# Altium project ProjectKvant3DPrinter.PrjPCB
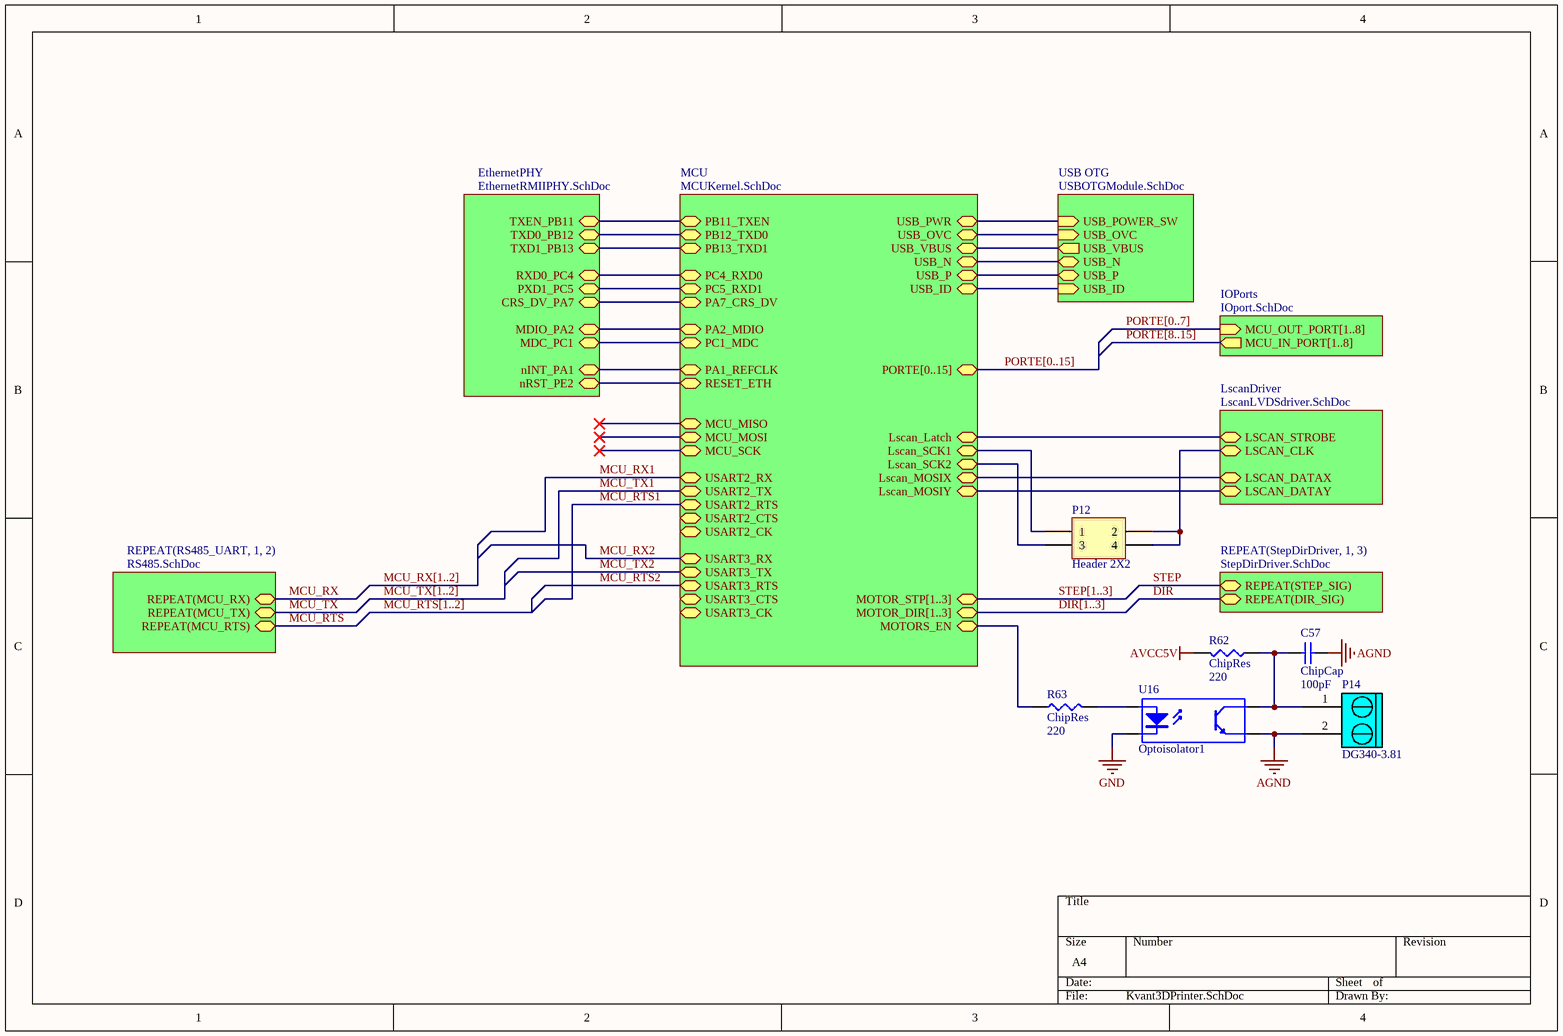
[diagram p0: Kvant3DPrinter.SchDoc]
6 sheets, 88 parts. Net scope: hierarchical (ports join the sheet entries above them; power ports are global).
Board file: PCBKvant3DPrinter_TopologicalSort.PcbDoc
Sheets:
  Kvant3DPrinter.SchDoc
    IOPorts = IOport.SchDoc
      InputPort1 = InputPort.SchDoc
      InputPort2 = InputPort.SchDoc
      InputPort3 = InputPort.SchDoc
      InputPort4 = InputPort.SchDoc
      InputPort5 = InputPort.SchDoc
      InputPort6 = InputPort.SchDoc
      InputPort7 = InputPort.SchDoc
      InputPort8 = InputPort.SchDoc
    LscanDriver = LscanLVDSdriver.SchDoc
    StepDirDriver1 = StepDirDriver.SchDoc
    StepDirDriver2 = StepDirDriver.SchDoc
    StepDirDriver3 = StepDirDriver.SchDoc
  MCUSetup.SchDoc

## Sheet Kvant3DPrinter.SchDoc
size A4

### Parts
C57  ChipCap  value 100pF  [CAP0805]
P12  Header 2X2  [HDR2X2]
P14  DG340-3.81  [DG340-3.81-02P-00A(H)]
R62  ChipRes  value 220  [RES0805]
R63  ChipRes  value 220  [RES0805]
U16  Optoisolator1  [DIP-4]

### Sub-sheets
EthernetPHY = EthernetRMIIPHY.SchDoc (file not in this document): TXEN_PB11, TXD0_PB12, TXD1_PB13, RXD0_PC4, PXD1_PC5, CRS_DV_PA7, MDIO_PA2, MDC_PC1, nINT_PA1, nRST_PE2
IOPorts = IOport.SchDoc: MCU_OUT_PORT[1..8] (in), MCU_IN_PORT[1..8] (out)
LscanDriver = LscanLVDSdriver.SchDoc: LSCAN_STROBE, LSCAN_CLK, LSCAN_DATAX, LSCAN_DATAY
MCU = MCUKernel.SchDoc (file not in this document): RESET_ETH, USB_PWR, USB_OVC, USB_VBUS, USB_N, USB_P, USB_ID, MCU_SCK, MCU_MISO, MCU_MOSI, PORTE[0..15] (bidir), PA2_MDIO, PC1_MDC, PA1_REFCLK, PA7_CRS_DV, PB11_TXEN, PB12_TXD0, PB13_TXD1, PC4_RXD0, PC5_RXD1, Lscan_Latch, Lscan_SCK1, Lscan_SCK2, Lscan_MOSIX, Lscan_MOSIY, USART2_CTS, USART2_RTS, USART2_TX, USART2_RX, USART2_CK, USART3_TX, USART3_RX, USART3_CK, USART3_CTS, USART3_RTS, MOTORS_EN, MOTOR_STP[1..3], MOTOR_DIR[1..3]
REPEAT(RS485_UART, 1, 2) = RS485.SchDoc (file not in this document): REPEAT(MCU_RX), REPEAT(MCU_TX), REPEAT(MCU_RTS)
REPEAT(StepDirDriver, 1, 3) = StepDirDriver.SchDoc: REPEAT(STEP_SIG), REPEAT(DIR_SIG)
USB OTG = USBOTGModule.SchDoc (file not in this document): USB_POWER_SW (in), USB_OVC (in), USB_VBUS (out), USB_N (bidir), USB_P (bidir), USB_ID (in)

### Nets
AGND: C57.2 P14.2 U16.3(E)
AVCC5V: R62.2
GND: U16.2(K)
DIR: sheet REPEAT(StepDirDriver, 1, 3)/REPEAT(DIR_SIG)
MCU_RTS: sheet REPEAT(RS485_UART, 1, 2)/REPEAT(MCU_RTS)
MCU_RTS1: sheet MCU/USART2_RTS
MCU_RTS2: sheet MCU/USART3_RTS
MCU_RX: sheet REPEAT(RS485_UART, 1, 2)/REPEAT(MCU_RX)
MCU_RX1: sheet MCU/USART2_RX
MCU_RX2: sheet MCU/USART3_RX
MCU_TX: sheet REPEAT(RS485_UART, 1, 2)/REPEAT(MCU_TX)
MCU_TX1: sheet MCU/USART2_TX
MCU_TX2: sheet MCU/USART3_TX
STEP: sheet REPEAT(StepDirDriver, 1, 3)/REPEAT(STEP_SIG)
NetC57_1: C57.1 P14.1 R62.1 U16.4(C)
NetP12_1: P12.1 ; sheet MCU/Lscan_SCK1
NetP12_2: P12.2 P12.4 ; sheet LscanDriver/LSCAN_CLK
NetP12_3: P12.3 ; sheet MCU/Lscan_SCK2
NetR56_1: sheet MCU/Lscan_Latch, sheet LscanDriver/LSCAN_STROBE
NetR58_1: sheet MCU/Lscan_MOSIX, sheet LscanDriver/LSCAN_DATAX
NetR59_1: sheet MCU/Lscan_MOSIY, sheet LscanDriver/LSCAN_DATAY
NetR63_1: R63.1 ; sheet MCU/MOTORS_EN
NetR63_2: R63.2 U16.1(A)
(unnamed): sheet MCU/RESET_ETH, sheet EthernetPHY/nRST_PE2
(unnamed): sheet MCU/USB_PWR, sheet USB OTG/USB_POWER_SW
(unnamed): sheet MCU/USB_OVC, sheet USB OTG/USB_OVC
(unnamed): sheet MCU/USB_VBUS, sheet USB OTG/USB_VBUS
(unnamed): sheet MCU/USB_N, sheet USB OTG/USB_N
(unnamed): sheet MCU/USB_P, sheet USB OTG/USB_P
(unnamed): sheet MCU/USB_ID, sheet USB OTG/USB_ID
(unnamed): sheet MCU/PA2_MDIO, sheet EthernetPHY/MDIO_PA2
(unnamed): sheet MCU/PC1_MDC, sheet EthernetPHY/MDC_PC1
(unnamed): sheet MCU/PA1_REFCLK, sheet EthernetPHY/nINT_PA1
(unnamed): sheet MCU/PA7_CRS_DV, sheet EthernetPHY/CRS_DV_PA7
(unnamed): sheet MCU/PB11_TXEN, sheet EthernetPHY/TXEN_PB11
(unnamed): sheet MCU/PB12_TXD0, sheet EthernetPHY/TXD0_PB12
(unnamed): sheet MCU/PB13_TXD1, sheet EthernetPHY/TXD1_PB13
(unnamed): sheet MCU/PC4_RXD0, sheet EthernetPHY/RXD0_PC4
(unnamed): sheet MCU/PC5_RXD1, sheet EthernetPHY/PXD1_PC5

### Buses and harness runs
bus DIR[1..3] = sheet MCU/MOTOR_DIR[1..3]
bus MCU_RTS[1..2]
bus MCU_RX[1..2]
bus MCU_TX[1..2]
bus PORTE[0..7] = sheet IOPorts/MCU_OUT_PORT[1..8]
bus PORTE[0..15] = sheet MCU/PORTE[0..15]
bus PORTE[8..15] = sheet IOPorts/MCU_IN_PORT[1..8]
bus STEP[1..3] = sheet MCU/MOTOR_STP[1..3]

### Library data of the parts
C57 = ChipCap: Capacitor; Published: 8-Jun-2000; LatestRevisionDate: 17-Jul-2002; LatestRevisionNote: Re-released for DXP Platform.; PackageReference: RAD-0.3; Publisher: Altium Limited
P12 = Header 2X2: Header, 2-Pin, Dual row; LatestRevisionDate: 17-Jul-2002; LatestRevisionNote: Re-released for DXP Platform.; Publisher: Altium Limited
P14 = DG340-3.81-02P: Terminal block
R62 R63 = ChipRes: Chip resistor
U16 = Optoisolator1: 4-Pin Phototransistor Optocoupler; Published: 24-Mar-1999; LatestRevisionDate: 04-Mar-2005; LatestRevisionNote: Sch pins 3 & 4 Swapped.; DatasheetVersion: Nov-2003; PackageReference: DIP-4; Publisher: Altium Limited

## Sheet IOport.SchDoc
size A4
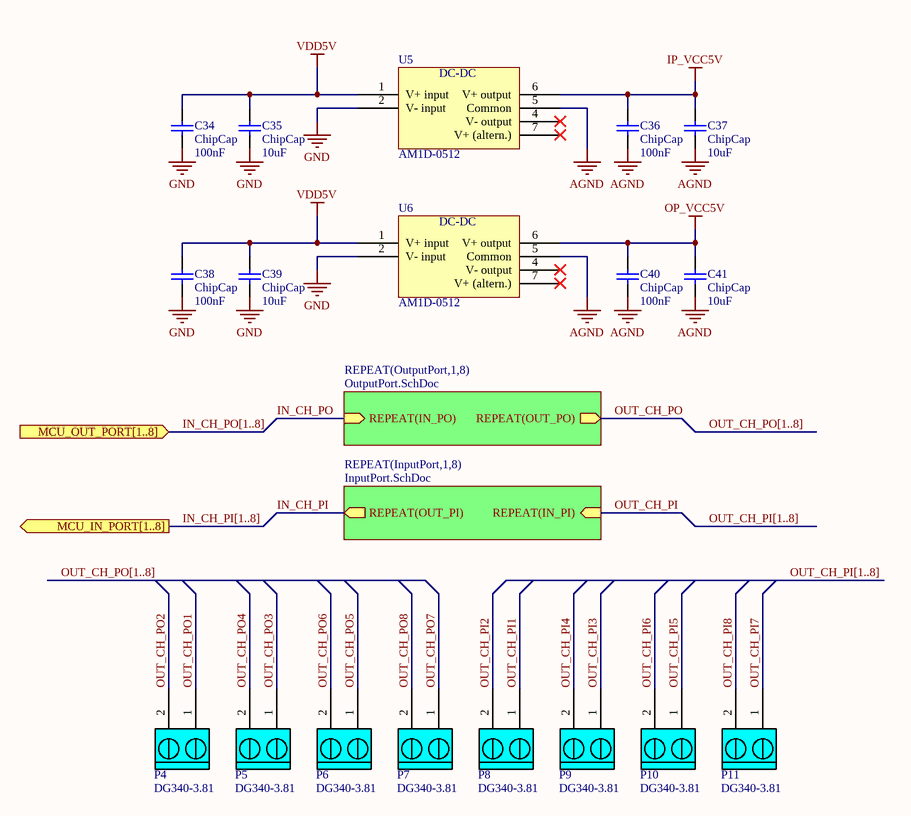
[diagram p1: IOport.SchDoc]

### Parts
C34  ChipCap  value 100nF  [CAP0805]
C35  ChipCap  value 10uF  [CAP0805]
C36  ChipCap  value 100nF  [CAP0805]
C37  ChipCap  value 10uF  [CAP0805]
C38  ChipCap  value 100nF  [CAP0805]
C39  ChipCap  value 10uF  [CAP0805]
C40  ChipCap  value 100nF  [CAP0805]
C41  ChipCap  value 10uF  [CAP0805]
P4  DG340-3.81  [DG340-3.81-02P-00A(H)]
P5  DG340-3.81  [DG340-3.81-02P-00A(H)]
P6  DG340-3.81  [DG340-3.81-02P-00A(H)]
P7  DG340-3.81  [DG340-3.81-02P-00A(H)]
P8  DG340-3.81  [DG340-3.81-02P-00A(H)]
P9  DG340-3.81  [DG340-3.81-02P-00A(H)]
P10  DG340-3.81  [DG340-3.81-02P-00A(H)]
P11  DG340-3.81  [DG340-3.81-02P-00A(H)]
U5  AM1D-0512  [SIP14]
U6  AM1D-0512  [SIP14]

### Sub-sheets
REPEAT(InputPort,1,8) = InputPort.SchDoc: REPEAT(IN_PI) (in), REPEAT(OUT_PI) (out)
REPEAT(OutputPort,1,8) = OutputPort.SchDoc (file not in this document): REPEAT(IN_PO) (in), REPEAT(OUT_PO) (out)

### Ports
MCU_IN_PORT[1..8] (out), MCU_OUT_PORT[1..8] (in)

### Nets
AGND: C36.1 C37.1 C40.1 C41.1 U5.5(Common) U6.5(Common)
GND: C34.1 C35.1 C38.1 C39.1 U5.2(V-_input) U6.2(V-_input)
IP_VCC5V: C36.2 C37.2 U5.6(V+_output)
OP_VCC5V: C40.2 C41.2 U6.6(V+_output)
VDD5V: C34.2 C35.2 C38.2 C39.2 U5.1(V+_input) U6.1(V+_input)
IN_CH_PI: sheet REPEAT(InputPort,1,8)/REPEAT(OUT_PI)
IN_CH_PO: sheet REPEAT(OutputPort,1,8)/REPEAT(IN_PO)
OUT_CH_PI: sheet REPEAT(InputPort,1,8)/REPEAT(IN_PI)
OUT_CH_PI1: P8.1
OUT_CH_PI2: P8.2
OUT_CH_PI3: P9.1
OUT_CH_PI4: P9.2
OUT_CH_PI5: P10.1
OUT_CH_PI6: P10.2
OUT_CH_PI7: P11.1
OUT_CH_PI8: P11.2
OUT_CH_PO: sheet REPEAT(OutputPort,1,8)/REPEAT(OUT_PO)
OUT_CH_PO1: P4.1
OUT_CH_PO2: P4.2
OUT_CH_PO3: P5.1
OUT_CH_PO4: P5.2
OUT_CH_PO5: P6.1
OUT_CH_PO6: P6.2
OUT_CH_PO7: P7.1
OUT_CH_PO8: P7.2

Not connected (* = marked no-connect by the designer): U5 4(V-_output)* 7(V+_(altern.))*; U6 4(V-_output)* 7(V+_(altern.))*

### Buses and harness runs
bus IN_CH_PI[1..8] = port MCU_IN_PORT[1..8]
bus IN_CH_PO[1..8] = port MCU_OUT_PORT[1..8]
bus OUT_CH_PI[1..8]
bus OUT_CH_PO[1..8]

### Notes on the sheet
- (in symbol AM1D-0512) DC-DC

### Library data of the parts
C34-C41 = ChipCap: Capacitor; Published: 8-Jun-2000; LatestRevisionDate: 17-Jul-2002; LatestRevisionNote: Re-released for DXP Platform.; PackageReference: RAD-0.3; Publisher: Altium Limited
P4-P11 = DG340-3.81-02P: Terminal block
U5 U6 = AM1D-0512: DC-DC 5-12V convertor

## Sheet InputPort.SchDoc
size A4
Used 8 times, as channels IOPorts/InputPort1, IOPorts/InputPort2, IOPorts/InputPort3, IOPorts/InputPort4, IOPorts/InputPort5, IOPorts/InputPort6, IOPorts/InputPort7, IOPorts/InputPort8. Parts and nets are listed once, with the designators drawn on the sheet.
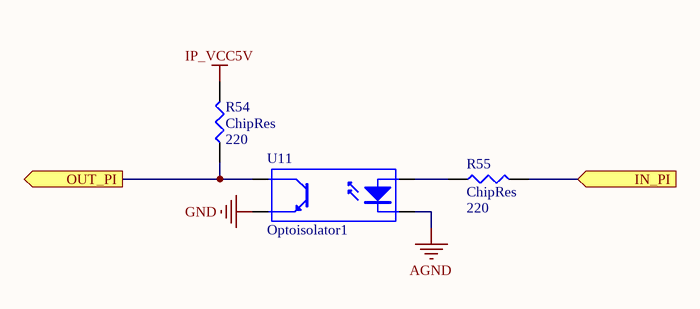
[diagram p2: InputPort.SchDoc]

### Parts
R54  ChipRes  value 220  [RES0805]
R55  ChipRes  value 220  [RES0805]
U11  Optoisolator1  [DIP-4]

### Ports
IN_PI (in), OUT_PI (out)

### Nets
AGND: U11.2(K)
GND: U11.3(E)
IP_VCC5V: R54.2
IN_PI: R55.2 ; port IN_PI
OUT_PI: R54.1 U11.4(C) ; port OUT_PI
NetR55_1: R55.1 U11.1(A)

### Channels
IOPorts/InputPort1: designators end in _InputPort1; ports IN_PI=OUT_CH_PI1 OUT_PI=IN_CH_PI1
IOPorts/InputPort2: designators end in _InputPort2; ports IN_PI=OUT_CH_PI2 OUT_PI=IN_CH_PI2
IOPorts/InputPort3: designators end in _InputPort3; ports IN_PI=OUT_CH_PI3 OUT_PI=IN_CH_PI3
IOPorts/InputPort4: designators end in _InputPort4; ports IN_PI=OUT_CH_PI4 OUT_PI=IN_CH_PI4
IOPorts/InputPort5: designators end in _InputPort5; ports IN_PI=OUT_CH_PI5 OUT_PI=IN_CH_PI5
IOPorts/InputPort6: designators end in _InputPort6; ports IN_PI=OUT_CH_PI6 OUT_PI=IN_CH_PI6
IOPorts/InputPort7: designators end in _InputPort7; ports IN_PI=OUT_CH_PI7 OUT_PI=IN_CH_PI7
IOPorts/InputPort8: designators end in _InputPort8; ports IN_PI=OUT_CH_PI8 OUT_PI=IN_CH_PI8

### Library data of the parts
R54 R55 = ChipRes: Chip resistor
U11 = Optoisolator1: 4-Pin Phototransistor Optocoupler; Published: 24-Mar-1999; LatestRevisionDate: 04-Mar-2005; LatestRevisionNote: Sch pins 3 & 4 Swapped.; DatasheetVersion: Nov-2003; PackageReference: DIP-4; Publisher: Altium Limited

## Sheet LscanLVDSdriver.SchDoc
size A4
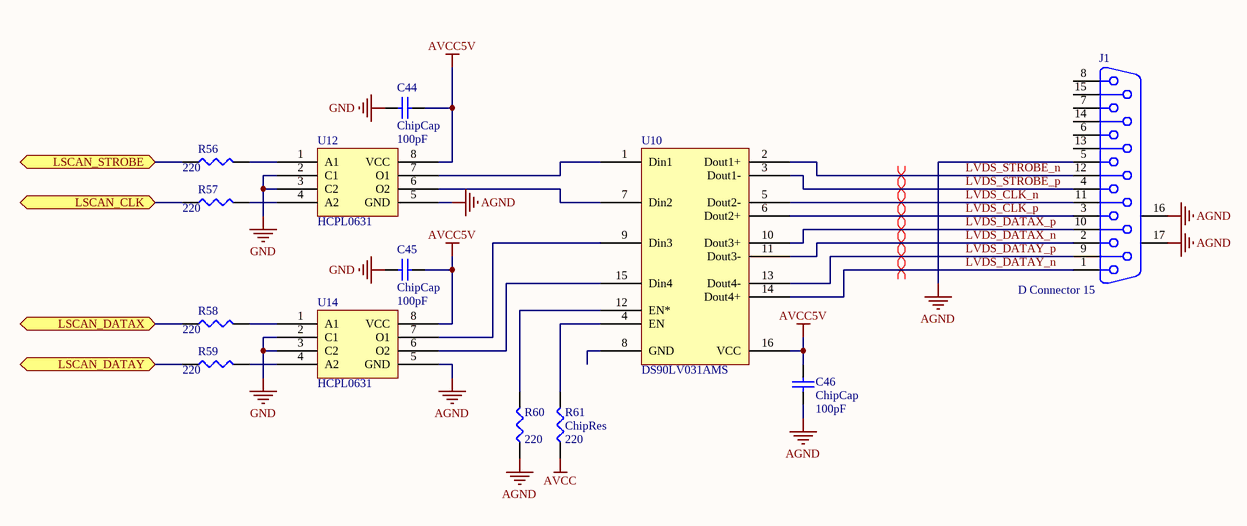
[diagram p3: LscanLVDSdriver.SchDoc]

### Parts
C44  ChipCap  value 100pF  [CAP0805]
C45  ChipCap  value 100pF  [CAP0805]
C46  ChipCap  value 100pF  [CAP0805]
J1  D Connector 15  [DSUB1.385-2H15]
R56  value 220  [RES0805]  (hidden comment: ChipRes)
R57  value 220  [RES0805]  (hidden comment: ChipRes)
R58  value 220  [RES0805]  (hidden comment: ChipRes)
R59  value 220  [RES0805]  (hidden comment: ChipRes)
R60  value 220  [RES0805]  (hidden comment: ChipRes)
R61  ChipRes  value 220  [RES0805]
U10  DS90LV031AMS  [SOIC16]
U12  HCPL0631  [SOIC8]
U14  HCPL0631  [SOIC8]

### Ports
LSCAN_CLK, LSCAN_DATAX, LSCAN_DATAY, LSCAN_STROBE

### Nets
AGND: C46.1 J1.5 J1.16(MH1) J1.17(MH2) R60.1 U12.5(GND) U14.5(GND)
AVCC: R61.1
AVCC5V: C44.1 C45.1 C46.2 U10.16(VCC) U12.8(VCC) U14.8(VCC)
GND: C44.2 C45.2 U12.2(C1) U12.3(C2) U14.2(C1) U14.3(C2)
LVDS_CLK_n: J1.11 U10.5(Dout2-)
LVDS_CLK_p: J1.3 U10.6(Dout2+)
LVDS_DATAX_n: J1.2 U10.11(Dout3-)
LVDS_DATAX_p: J1.10 U10.10(Dout3+)
LVDS_DATAY_n: J1.1 U10.14(Dout4+)
LVDS_DATAY_p: J1.9 U10.13(Dout4-)
LVDS_STROBE_n: J1.12 U10.2(Dout1+)
LVDS_STROBE_p: J1.4 U10.3(Dout1-)
NetP12_2: R57.1 ; port LSCAN_CLK
NetR56_1: R56.1 ; port LSCAN_STROBE
NetR56_2: R56.2 U12.1(A1)
NetR57_2: R57.2 U12.4(A2)
NetR58_1: R58.1 ; port LSCAN_DATAX
NetR58_2: R58.2 U14.1(A1)
NetR59_1: R59.1 ; port LSCAN_DATAY
NetR59_2: R59.2 U14.4(A2)
NetR60_2: R60.2 U10.12(EN*)
NetR61_2: R61.2 U10.4(EN)
NetU10_1: U10.1(Din1) U12.7(O1)
NetU10_7: U10.7(Din2) U12.6(O2)
NetU10_9: U10.9(Din3) U14.7(O1)
NetU10_15: U10.15(Din4) U14.6(O2)

Not connected (* = marked no-connect by the designer): J1 6 7 8 13 14 15; U10 8(GND)

### Layout directives
differential pair: LVDS_CLK_n, LVDS_CLK_p, LVDS_DATAX_n, LVDS_DATAX_p, LVDS_DATAY_n, LVDS_DATAY_p, LVDS_STROBE_n, LVDS_STROBE_p

### Library data of the parts
C44-C46 = ChipCap: Capacitor; Published: 8-Jun-2000; LatestRevisionDate: 17-Jul-2002; LatestRevisionNote: Re-released for DXP Platform.; PackageReference: RAD-0.3; Publisher: Altium Limited
J1 = D Connector 15: Receptacle Assembly, 15 Position, Right Angle; PackageDocument: O; Positions: 15; Published: 15-Jun-2001; LatestRevisionDate: 17-Jul-2002; LatestRevisionNote: Re-released for DXP Platform.; DatasheetDocument: 1-Sep-99; PackageReference: 788757; Publisher: Altium Limited; Orientation: Right Angle; Gender: Receptacle
R56-R61 = ChipRes: Chip resistor
U10 = DS90LV031AMS: 3V LVDS Quad CMOS Differential Line Driver
U12 U14 = HCPL0631: 2-channel opto-coupler

## Sheet StepDirDriver.SchDoc
size A4
Used 3 times, as channels StepDirDriver1, StepDirDriver2, StepDirDriver3. Parts and nets are listed once, with the designators drawn on the sheet.
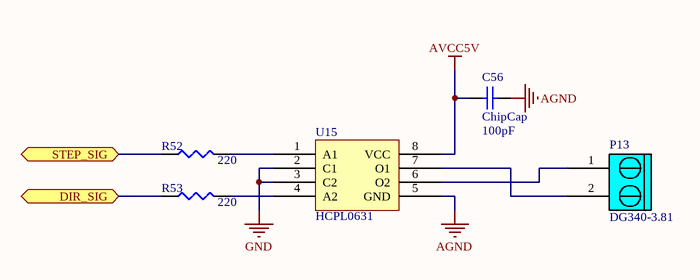
[diagram p4: StepDirDriver.SchDoc]

### Parts
C56  ChipCap  value 100pF  [CAP0805]
P13  DG340-3.81  [DG340-3.81-02P-00A(H)]
R52  value 220  [RES0805]  (hidden comment: ChipRes)
R53  value 220  [RES0805]  (hidden comment: ChipRes)
U15  HCPL0631  [SOIC8]

### Ports
DIR_SIG, STEP_SIG

### Nets
AGND: C56.2 U15.5(GND)
AVCC5V: C56.1 U15.8(VCC)
GND: U15.2(C1) U15.3(C2)
DIR_SIG: R53.1 ; port DIR_SIG
STEP_SIG: R52.1 ; port STEP_SIG
NetP13_1: P13.1 U15.6(O2)
NetP13_2: P13.2 U15.7(O1)
NetR52_2: R52.2 U15.1(A1)
NetR53_2: R53.2 U15.4(A2)

### Channels
StepDirDriver1: designators end in _StepDirDriver1; ports DIR_SIG=DIR1 STEP_SIG=STEP1
StepDirDriver2: designators C56=C56_2 P13=P13_StepDirDriver2 R52=R52_StepDirDriver2 R53=R53_StepDirDriver2 U15=U15_StepDirDriver2; ports DIR_SIG=DIR2 STEP_SIG=STEP2
StepDirDriver3: designators C56=C56_3 P13=P13_StepDirDriver3 R52=R52_StepDirDriver3 R53=R53_StepDirDriver3 U15=U15_StepDirDriver3; ports DIR_SIG=DIR3 STEP_SIG=STEP3

### Library data of the parts
C56 = ChipCap: Capacitor; Published: 8-Jun-2000; LatestRevisionDate: 17-Jul-2002; LatestRevisionNote: Re-released for DXP Platform.; PackageReference: RAD-0.3; Publisher: Altium Limited
P13 = DG340-3.81-02P: Terminal block
R52 R53 = ChipRes: Chip resistor
U15 = HCPL0631: 2-channel opto-coupler

## Sheet MCUSetup.SchDoc
size A4
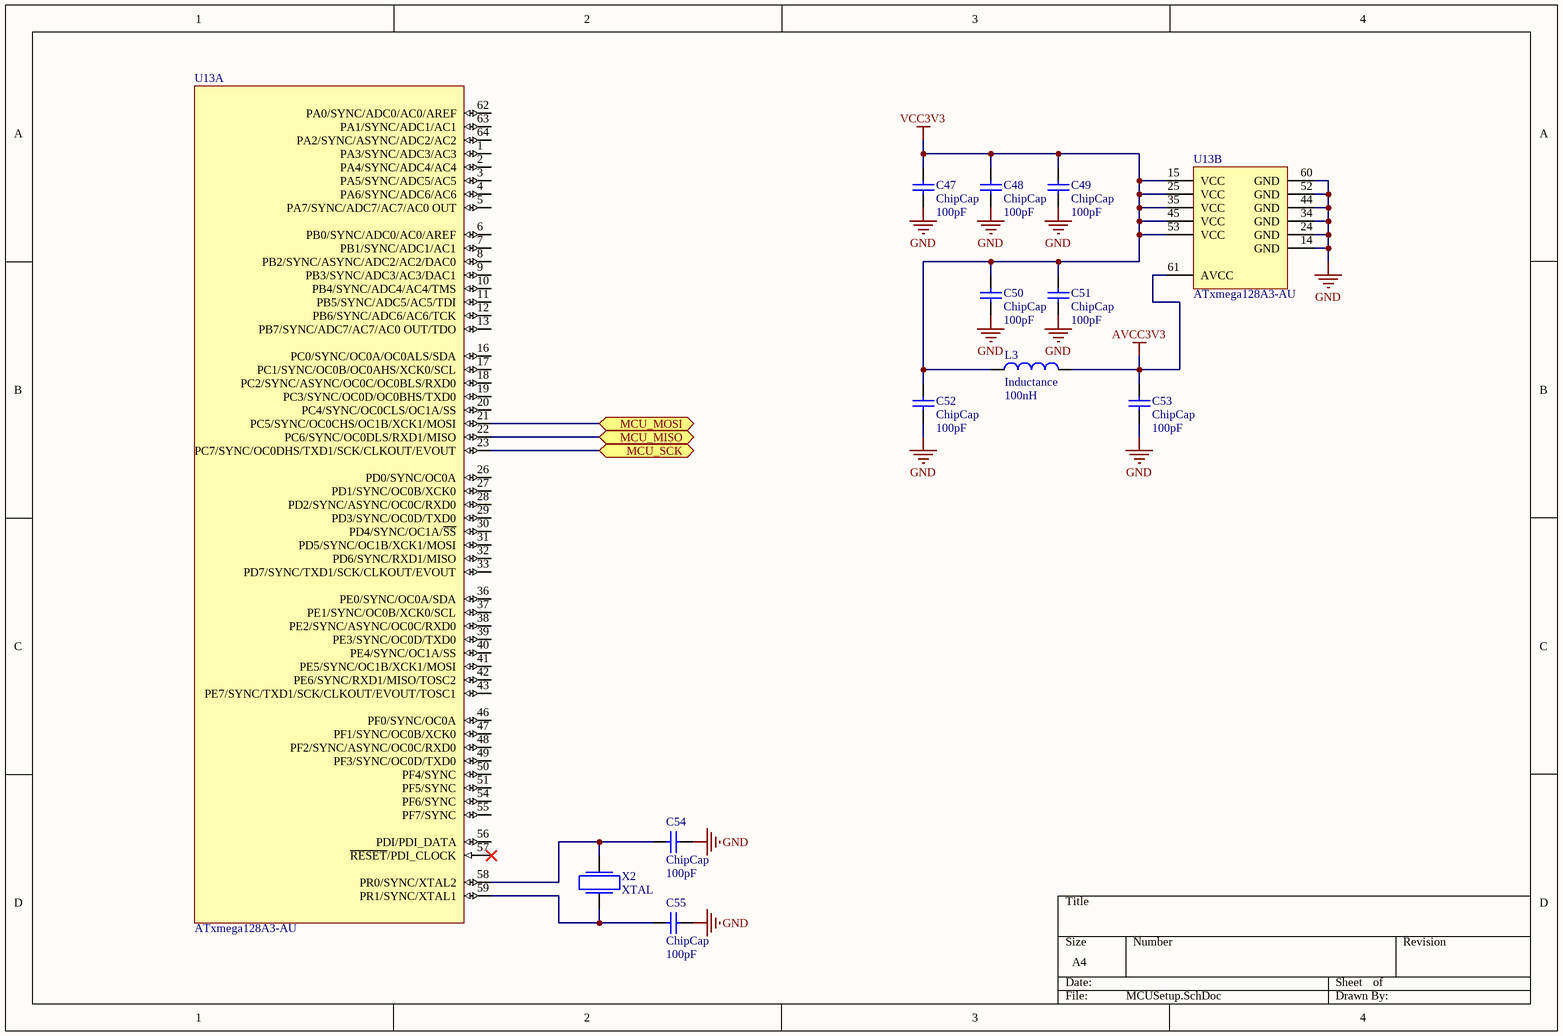
[diagram p5: MCUSetup.SchDoc]

### Parts
C47  ChipCap  value 100pF  [CAP0805]
C48  ChipCap  value 100pF  [CAP0805]
C49  ChipCap  value 100pF  [CAP0805]
C50  ChipCap  value 100pF  [CAP0805]
C51  ChipCap  value 100pF  [CAP0805]
C52  ChipCap  value 100pF  [CAP0805]
C53  ChipCap  value 100pF  [CAP0805]
C54  ChipCap  value 100pF  [CAP0805]
C55  ChipCap  value 100pF  [CAP0805]
L3  Inductance  value 100nH  [CM45]
U13  ATxmega128A3-AU  [64A_N]  (parts A,B of 2)
X2  XTAL  [BCY-W2/E4.7]

### Ports
MCU_MISO, MCU_MOSI, MCU_SCK

### Nets
AVCC3V3: C53.2 L3.1 U13.61(AVCC)
GND: C47.1 C48.1 C49.1 C50.1 C51.1 C52.1 C53.1 C54.2 C55.2 U13.14(GND) U13.24(GND) U13.34(GND) U13.44(GND) U13.52(GND) U13.60(GND)
VCC3V3: C47.2 C48.2 C49.2 C50.2 C51.2 C52.2 L3.2 U13.15(VCC) U13.25(VCC) U13.35(VCC) U13.45(VCC) U13.53(VCC)
NetC54_1: C54.1 U13.58(PR0/SYNC/XTAL2) X2.2
NetC55_1: C55.1 U13.59(PR1/SYNC/XTAL1) X2.1
NetU13_21: U13.21(PC5/SYNC/OC0CHS/OC1B/XCK1/MOSI) ; port MCU_MOSI
NetU13_22: U13.22(PC6/SYNC/OC0DLS/RXD1/MISO) ; port MCU_MISO
NetU13_23: U13.23(PC7/SYNC/OC0DHS/TXD1/SCK/CLKOUT/EVOUT) ; port MCU_SCK

Not connected (* = marked no-connect by the designer): U13 1(PA3/SYNC/ADC3/AC3) 2(PA4/SYNC/ADC4/AC4) 3(PA5/SYNC/ADC5/AC5) 4(PA6/SYNC/ADC6/AC6) 5(PA7/SYNC/ADC7/AC7/AC0_OUT) 6(PB0/SYNC/ADC0/AC0/AREF) 7(PB1/SYNC/ADC1/AC1) 8(PB2/SYNC/ASYNC/ADC2/AC2/DAC0) 9(PB3/SYNC/ADC3/AC3/DAC1) 10(PB4/SYNC/ADC4/AC4/TMS) 11(PB5/SYNC/ADC5/AC5/TDI) 12(PB6/SYNC/ADC6/AC6/TCK) 13(PB7/SYNC/ADC7/AC7/AC0_OUT/TDO) 16(PC0/SYNC/OC0A/OC0ALS/SDA) 17(PC1/SYNC/OC0B/OC0AHS/XCK0/SCL) 18(PC2/SYNC/ASYNC/OC0C/OC0BLS/RXD0) 19(PC3/SYNC/OC0D/OC0BHS/TXD0) 20(PC4/SYNC/OC0CLS/OC1A/SS) 26(PD0/SYNC/OC0A) 27(PD1/SYNC/OC0B/XCK0) 28(PD2/SYNC/ASYNC/OC0C/RXD0) 29(PD3/SYNC/OC0D/TXD0) 30(PD4/SYNC/OC1A/~{SS}) 31(PD5/SYNC/OC1B/XCK1/MOSI) 32(PD6/SYNC/RXD1/MISO) 33(PD7/SYNC/TXD1/SCK/CLKOUT/EVOUT) 36(PE0/SYNC/OC0A/SDA) 37(PE1/SYNC/OC0B/XCK0/SCL) 38(PE2/SYNC/ASYNC/OC0C/RXD0) 39(PE3/SYNC/OC0D/TXD0) 40(PE4/SYNC/OC1A/SS) 41(PE5/SYNC/OC1B/XCK1/MOSI) 42(PE6/SYNC/RXD1/MISO/TOSC2) 43(PE7/SYNC/TXD1/SCK/CLKOUT/EVOUT/TOSC1) 46(PF0/SYNC/OC0A) 47(PF1/SYNC/OC0B/XCK0) 48(PF2/SYNC/ASYNC/OC0C/RXD0) 49(PF3/SYNC/OC0D/TXD0) 50(PF4/SYNC) 51(PF5/SYNC) 54(PF6/SYNC) 55(PF7/SYNC) 56(PDI/PDI_DATA) 57(~{RESET}/PDI_CLOCK)* 62(PA0/SYNC/ADC0/AC0/AREF) 63(PA1/SYNC/ADC1/AC1) 64(PA2/SYNC/ASYNC/ADC2/AC2)

### Library data of the parts
C47-C55 = ChipCap: Capacitor; Published: 8-Jun-2000; LatestRevisionDate: 17-Jul-2002; LatestRevisionNote: Re-released for DXP Platform.; PackageReference: RAD-0.3; Publisher: Altium Limited
L3 = ChipInductance
U13 = ATxmega128A3-AU: 8/16-bit AVR XMEGA A3 Microcontroller, 1.6-3.6V, 128KB + 8KB Flash, 2KB EEPROM, 8KB SRAM, 64-pin TQFP, Industrial Grade (-40°C to 85°C), Pb-Free; Published: 1-Apr-2010; DatasheetVersion: revQ, Feb-2010; PackageVersion: revB, Oct-2001; PackageReference: 64A; Publisher: Altium Limited; PackageDescription: 64-Pin Plastic Thin Profile Quad Flat Pack, 14 x 14 x 1.0 mm Body, 0.8 mm Pitch (TQFP); Supplier 1: Digi-Key; Supplier Part Number 1: ATXMEGA128A3-AU-ND; Supplier 2: Farnell; Supplier Part Number 2: 1748550; Supplier 3: Mouser; Supplier Part Number 3: 556-ATXMEGA128A3-AU; Code_JEDEC: MS-026-AEB; ComponentLink1Description: Manufacturer Link; ComponentLink1URL: http://www.atmel.com/products/avr/default.asp?; ComponentLink2Description: ATxmega64A3/128A3/192A3/256A3 Datasheet; ComponentLink2URL: http://www.atmel.com/dyn/resources/prod_documents/doc8068.pdf; ComponentLink3Description: Atmel.com Home; ComponentLink3URL: http://www.atmel.com
X2 = Crystall oscillator: Quartz crystall oscillator

## Nets that join several sheets
AGND: Kvant3DPrinter (C57.2 P14.2 U16.3), IOport (6 pins), IOPorts/InputPort1 (U11_InputPort1.2), IOPorts/InputPort2 (U11_InputPort2.2), IOPorts/InputPort3 (U11_InputPort3.2), IOPorts/InputPort4 (U11_InputPort4.2), IOPorts/InputPort5 (U11_InputPort5.2), IOPorts/InputPort6 (U11_InputPort6.2), IOPorts/InputPort7 (U11_InputPort7.2), IOPorts/InputPort8 (U11_InputPort8.2), LscanLVDSdriver (7 pins), StepDirDriver1 (C56_StepDirDriver1.2 U15_StepDirDriver1.5), StepDirDriver2 (C56_2.2 U15_StepDirDriver2.5), StepDirDriver3 (C56_3.2 U15_StepDirDriver3.5)
AVCC5V: Kvant3DPrinter (R62.2), LscanLVDSdriver (6 pins), StepDirDriver1 (C56_StepDirDriver1.1 U15_StepDirDriver1.8), StepDirDriver2 (C56_2.1 U15_StepDirDriver2.8), StepDirDriver3 (C56_3.1 U15_StepDirDriver3.8)
GND: Kvant3DPrinter (U16.2), IOport (6 pins), IOPorts/InputPort1 (U11_InputPort1.3), IOPorts/InputPort2 (U11_InputPort2.3), IOPorts/InputPort3 (U11_InputPort3.3), IOPorts/InputPort4 (U11_InputPort4.3), IOPorts/InputPort5 (U11_InputPort5.3), IOPorts/InputPort6 (U11_InputPort6.3), IOPorts/InputPort7 (U11_InputPort7.3), IOPorts/InputPort8 (U11_InputPort8.3), LscanLVDSdriver (6 pins), StepDirDriver1 (U15_StepDirDriver1.2 U15_StepDirDriver1.3), StepDirDriver2 (U15_StepDirDriver2.2 U15_StepDirDriver2.3), StepDirDriver3 (U15_StepDirDriver3.2 U15_StepDirDriver3.3), MCUSetup (15 pins)
IP_VCC5V: IOport (C36.2 C37.2 U5.6), IOPorts/InputPort1 (R54_InputPort1.2), IOPorts/InputPort2 (R54_InputPort2.2), IOPorts/InputPort3 (R54_InputPort3.2), IOPorts/InputPort4 (R54_InputPort4.2), IOPorts/InputPort5 (R54_InputPort5.2), IOPorts/InputPort6 (R54_InputPort6.2), IOPorts/InputPort7 (R54_InputPort7.2), IOPorts/InputPort8 (R54_InputPort8.2)
NetP12_2: Kvant3DPrinter (P12.2 P12.4), LscanLVDSdriver (R57.1)
OUT_CH_PI1: IOport (P8.1), IOPorts/InputPort1 (R55_InputPort1.2)
OUT_CH_PI2: IOport (P8.2), IOPorts/InputPort2 (R55_InputPort2.2)
OUT_CH_PI3: IOport (P9.1), IOPorts/InputPort3 (R55_InputPort3.2)
OUT_CH_PI4: IOport (P9.2), IOPorts/InputPort4 (R55_InputPort4.2)
OUT_CH_PI5: IOport (P10.1), IOPorts/InputPort5 (R55_InputPort5.2)
OUT_CH_PI6: IOport (P10.2), IOPorts/InputPort6 (R55_InputPort6.2)
OUT_CH_PI7: IOport (P11.1), IOPorts/InputPort7 (R55_InputPort7.2)
OUT_CH_PI8: IOport (P11.2), IOPorts/InputPort8 (R55_InputPort8.2)